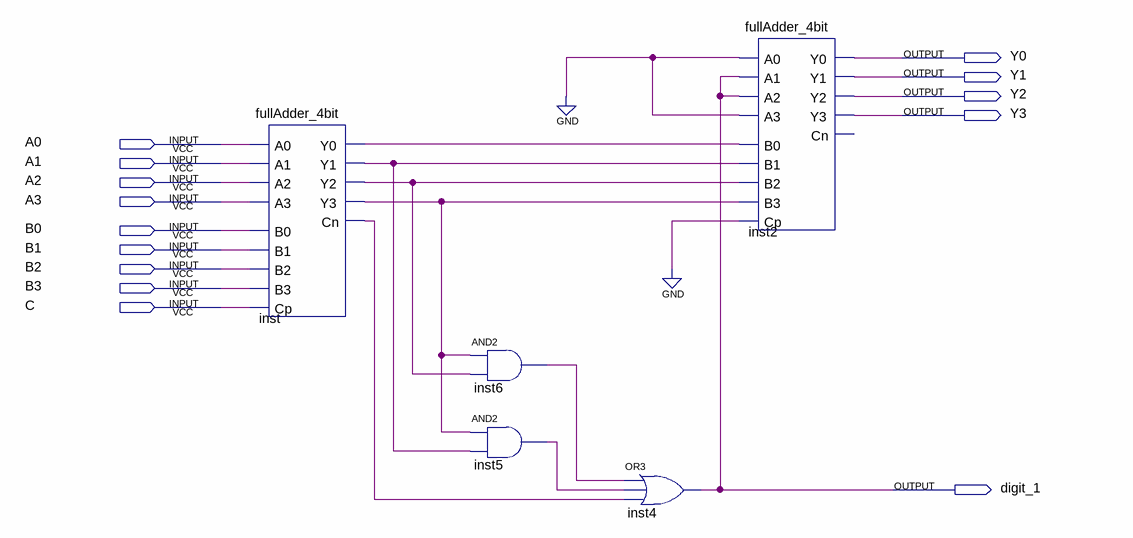
[diagram p0: schematic sheet]
// Quartus schematic BCD_digit.bdf as structural Verilog: 5 symbols, 14 pins
module BCD_digit (
  input  A0,
  input  A1,
  input  A2,
  input  A3,
  input  B0,
  input  B1,
  input  B2,
  input  B3,
  input  C,
  output Y0,
  output Y1,
  output Y2,
  output Y3,
  output digit_1
);

  wire inst5_out, inst6_out, inst_cn, inst_y0, inst_y1, inst_y2, inst_y3;

  fullAdder_4bit inst (
    .A0(A0), .B0(B0), .Cp(C), .A1(A1), .B1(B1), .A2(A2), .B2(B2), .A3(A3), .B3(B3), .Y0(inst_y0),
    .Y1(inst_y1), .Y2(inst_y2), .Cn(inst_cn), .Y3(inst_y3));
  and inst6 (inst6_out, inst_y3, inst_y2);
  and inst5 (inst5_out, inst_y3, inst_y1);
  or inst4 (digit_1, inst6_out, inst5_out, inst_cn);
  fullAdder_4bit inst2 (
    .A0(1'b0), .B0(inst_y0), .Cp(1'b0), .A1(digit_1), .B1(inst_y1), .A2(digit_1), .B2(inst_y2), .A3(1'b0),
    .B3(inst_y3), .Y0(Y0), .Y1(Y1), .Y2(Y2), .Y3(Y3));  // open: Cn
endmodule
